# EAGLE design pizerousbhub (EAGLE 7.5.0)
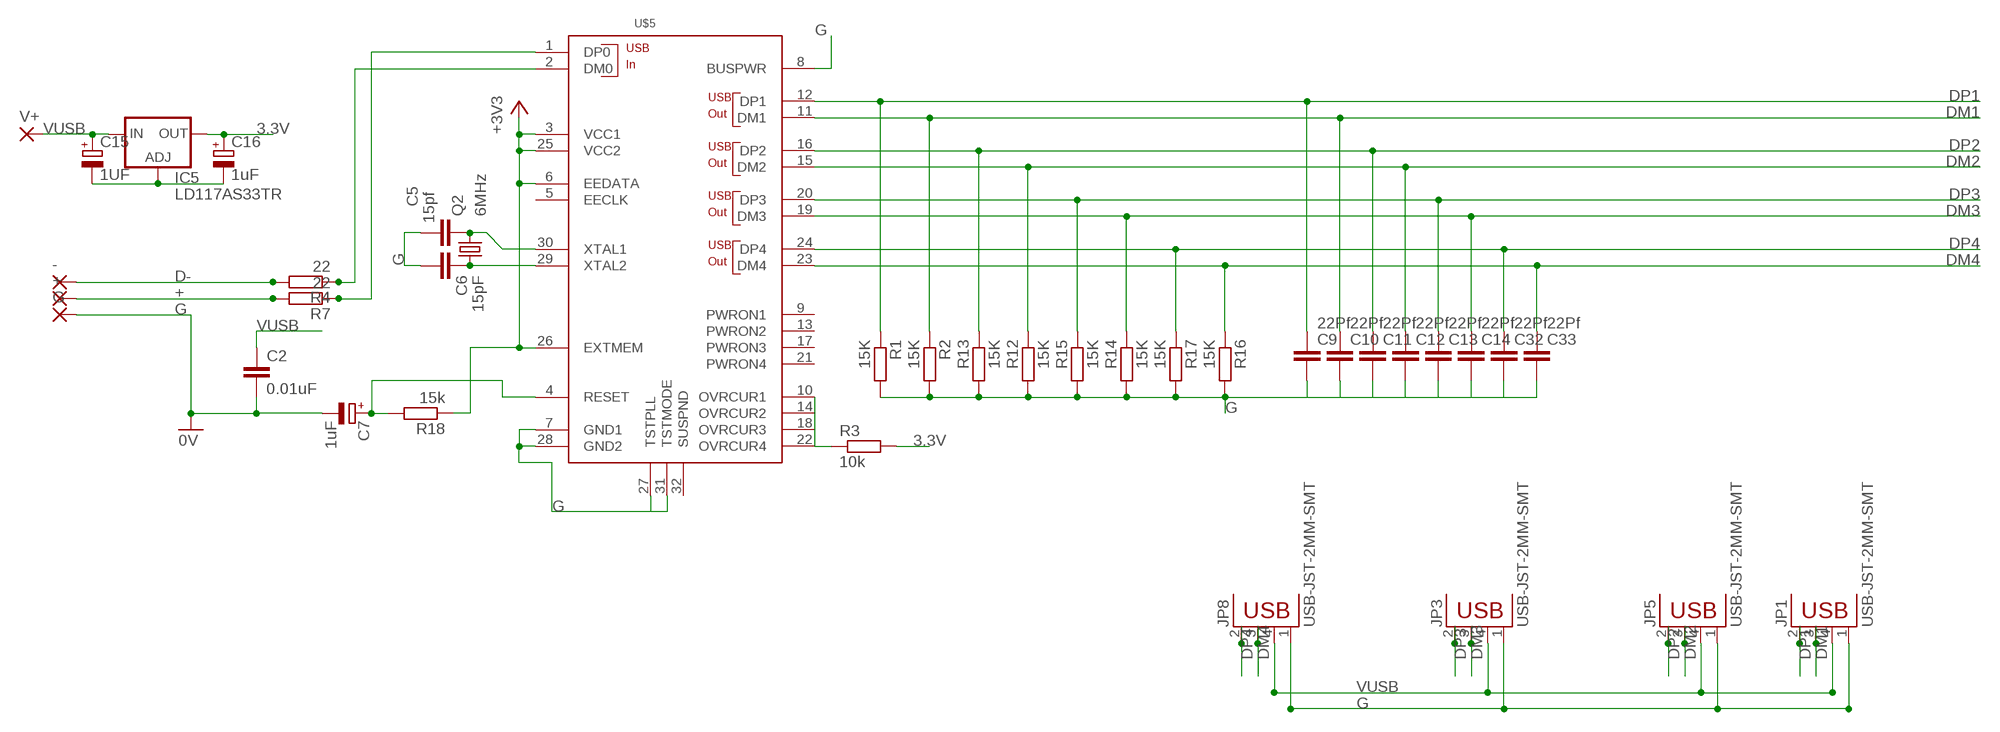
[diagram p0: schematic, sheet 1]

## Parts
+  SMD2  [SMD1,27-2,54]
-  SMD2  [SMD1,27-2,54]
C2  0.01uF  C-EUC0603  [C0603]
C5  15pf  C-EUC0603  [C0603]
C6  15pF  C-EUC0603  [C0603]
C7  1uF  CPOL-EUA/3216-18W  [A/3216-18W]
C9  22Pf  C-EUC0603  [C0603]
C10  22Pf  C-EUC0603  [C0603]
C11  22Pf  C-EUC0603  [C0603]
C12  22Pf  C-EUC0603  [C0603]
C13  22Pf  C-EUC0603  [C0603]
C14  22Pf  C-EUC0603  [C0603]
C15  1UF  CPOL-EUA/3216-18W  [A/3216-18W]
C16  1uF  CPOL-EUC/6032-28R  [C/6032-28R]
C32  22Pf  C-EUC0603  [C0603]
C33  22Pf  C-EUC0603  [C0603]
G  SMD2  [SMD1,27-2,54]
IC5  LD117AS33TR  [SOT223]
JP1  USB-JST-2MM-SMT  [S4B-PH]
JP3  USB-JST-2MM-SMT  [S4B-PH]
JP5  USB-JST-2MM-SMT  [S4B-PH]
JP8  USB-JST-2MM-SMT  [S4B-PH]
Q2  6MHz  CRYSTALCTS406  [CTS406]
R1  15K  R-EU_R0603  [R0603]
R2  15K  R-EU_R0603  [R0603]
R3  10k  R-EU_R0603  [R0603]
R4  22  R-EU_R0603  [R0603]
R7  22  R-EU_R0603  [R0603]
R12  15K  R-EU_R0603  [R0603]
R13  15K  R-EU_R0603  [R0603]
R14  15K  R-EU_R0603  [R0603]
R15  15K  R-EU_R0603  [R0603]
R16  15K  R-EU_R0603  [R0603]
R17  15K  R-EU_R0603  [R0603]
R18  15k  R-EU_R0603  [R0603]
U$5  TUSB2046  [LQFP-32]
V+  SMD2  [SMD1,27-2,54]

## Nets
3.3V: C16.+ IC5.4(OUT) R3.2 R18.1 U$5.3(VCC1) U$5.6(EEDATA) U$5.25(VCC2) U$5.26(EXTMEM) ; supply symbol labelled +3V3
+: +.1(P) R7.2
D-: -.1(P) R4.2
DM0: R4.1 U$5.2(DM0)
DM1: C10.1 JP1.3(D-) R2.1 U$5.11(DM1)
DM2: C12.1 JP5.3(D-) R12.1 U$5.15(DM2)
DM3: C14.1 JP3.3(D-) R14.1 U$5.19(DM3)
DM4: C33.1 JP8.3(D-) R16.1 U$5.23(DM4)
DP0: R7.1 U$5.1(DP0)
DP1: C9.1 JP1.2(D+) R1.1 U$5.12(DP1)
DP2: C11.1 JP5.2(D+) R13.1 U$5.16(DP2)
DP3: C13.1 JP3.2(D+) R15.1 U$5.20(DP3)
DP4: C32.1 JP8.2(D+) R17.1 U$5.24(DP4)
G: C2.2 C5.1 C6.2 C7.- C9.2 C10.2 C11.2 C12.2 C13.2 C14.2 C15.- C16.- C32.2 C33.2 G.1(P) IC5.1(ADJ) JP1.1(GND) JP3.1(GND) JP5.1(GND) JP8.1(GND) R1.2 R2.2 R12.2 R13.2 R14.2 R15.2 R16.2 R17.2 U$5.7(GND1) U$5.8(BUSPWR) U$5.27(TSTPLL) U$5.28(GND2) U$5.31(TSTMODE) ; supply symbol labelled 0V
N$3: R3.1 U$5.10(OVRCUR1) U$5.14(OVRCUR2) U$5.18(OVRCUR3) U$5.22(OVRCUR4)
RESET: C7.+ R18.2 U$5.4(RESET)
VUSB: C2.1 C15.+ IC5.3(IN) JP1.4(VBUS) JP3.4(VBUS) JP5.4(VBUS) JP8.4(VBUS) V+.1(P)
XTAL1: C5.2 Q2.3 U$5.30(XTAL1)
XTAL2: C6.1 Q2.1 U$5.29(XTAL2)
Unconnected: U$5.5(EECLK) U$5.9(PWRON1) U$5.13(PWRON2) U$5.17(PWRON3) U$5.21(PWRON4) U$5.32(SUSPND)

## Library data of the parts
+ - G V+ = wirepad:SMD2: SMD PAD
C2 C5 C6 C9-C14 C32 C33 = rcl:C-EU: CAPACITOR, European symbol
C7 C15 C16 = rcl:CPOL-EU: POLARIZED CAPACITOR, European symbol
IC5 = v-reg:LD117A?*: Low drop fixed and adjustable positive voltage regulators 1 A Source: http://www.st.com/stonline/products/literature/ds/7194/ld1117axx.pdf
JP1 JP3 JP5 JP8 = SparkFun-Connectors:USB: USB Connectors USB-B-PTH is fully proven SKU : PRT-00139/CONN-08278 USB-miniB is fully proven SKU : PRT-00587 USB-A-PCB is untested. USB-A-H is throughly reviewed, but untested. Spark Fun Electronics SKU : PRT-00437 USB-B-SMT is throughly reviewed, but untested. Needs silkscreen touching up. USB-A-S has not been used/tested USB-MB-H has not been used/tested USB-MICROB has been used. CONN-09505; PROD_ID: CONN-08193
Q2 = new_mcp:CRYSTAL: CRYSTAL
R1-R4 R7 R12-R18 = rcl:R-EU_: RESISTOR, European symbol
U$5 = usb-conc:TUSB2046; ORDERCODE: 1470507; SUPPLIER: farnell

## Net classes
1 power: width 0.6 mm, clearance 0.305 mm

## Board
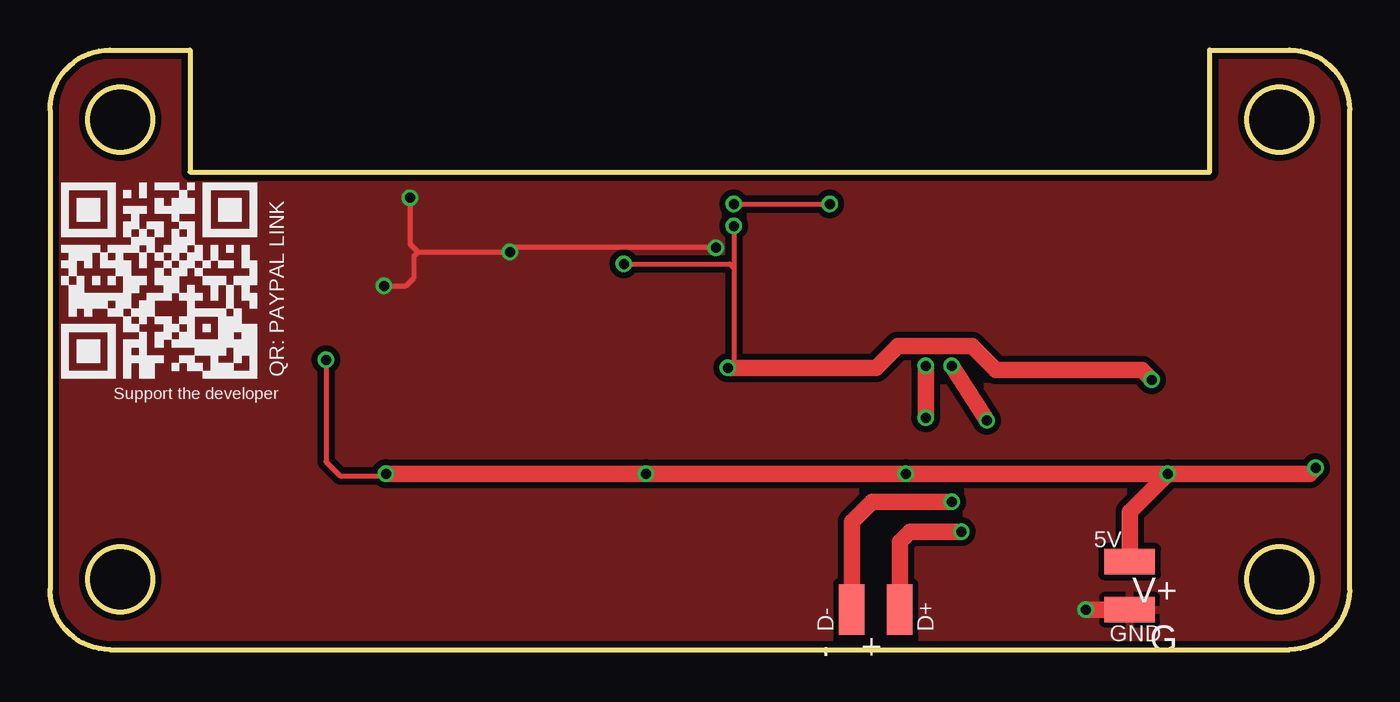
[diagram p1: board, top side]
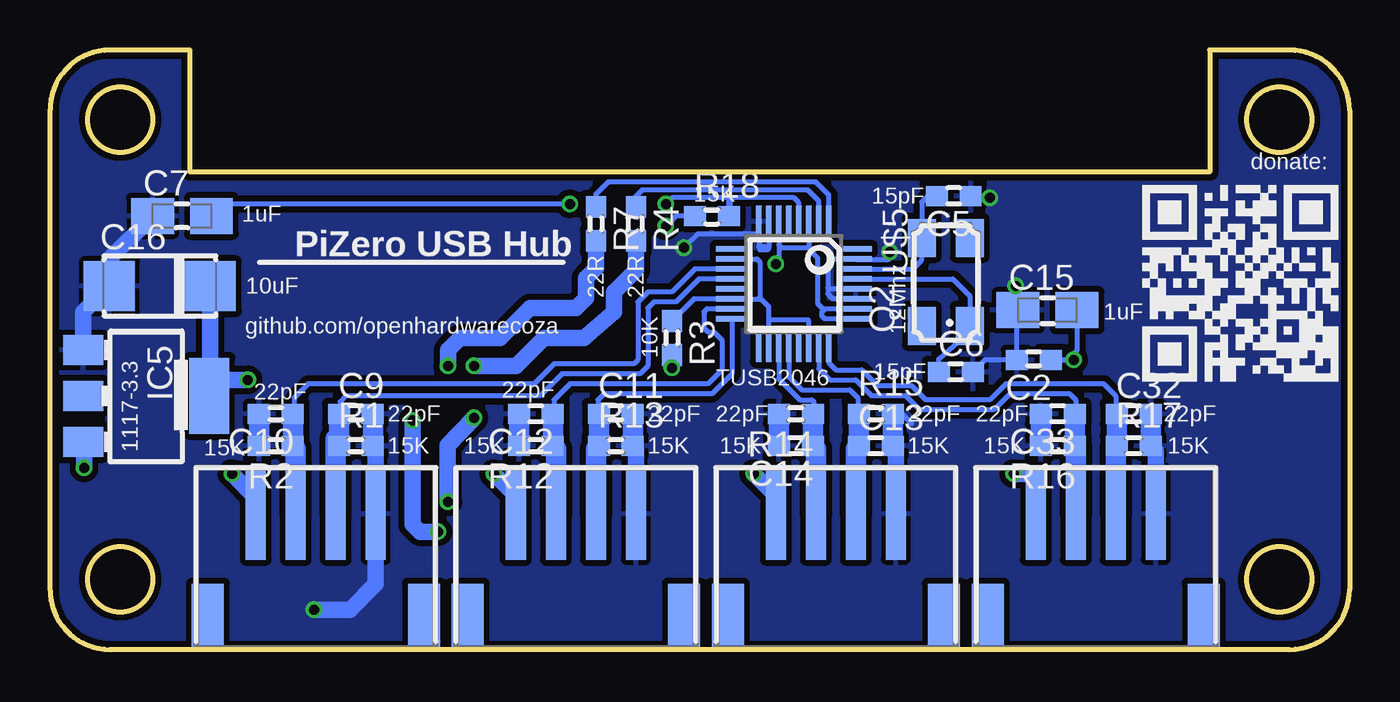
[diagram p2: board, bottom side, seen from below]

Size 65 x 30 mm. Coordinates in mm from the lower left corner, seen from the top.
Outline: 3,30 7,30 7,23.9 58,23.9 58,30 62,30 arc-90 65,27 65,3 arc-90 62,0 3,0 arc-90 0,3 0,27 arc-90 3,30
Outline: circle at 3.51,26.52 radius 1.62
Outline: circle at 61.49,26.52 radius 1.62
Outline: circle at 61.49,3.51 radius 1.62
Outline: circle at 3.51,3.51 radius 1.62
Copper layers (1*16): Top 0.035mm / dielectric 1.5mm / Bottom 0.035mm
Design rules "dirt_cheap_dirty_boards.v1": minimum track width 5mil, minimum drill 12mil, track to track 5mil, track to pad 5mil, pad to pad 5mil, via to via 5mil, smd to smd 0mil, copper to edge 10mil, drill to drill 10mil, minimum pad ring 10mil, minimum via ring 6mil, stop-mask expansion 2mil, vias tented up to drill 25mil, thermal gap 10mil

### Footprints (pad centres in the part's own frame; a part is rotated, then mirrored left to right if it is on the bottom)
SMD1,27-2,54 = smd 1.27 x 2.54: 1 0,0
C0603 = smd 1.1 x 1: 1 -0.85,0; 2 0.85,0
A/3216-18W = smd 2.15 x 1.8: + 1.475,0; - -1.475,0
C/6032-28R = smd 2.55 x 2.5: + 2.525,0; - -2.525,0
SOT223 = smd 1.5 x 2: 1 -2.3,-3.15; 2 0,-3.15; 3 2.3,-3.15 | smd 3.8 x 2: 4 0,3.15
S4B-PH = smd 1 x 4.6: 1 -3,-4.7; 2 -1,-4.7; 3 1,-4.7; 4 3,-4.7 | smd 1.6 x 3.4: P$1 -5.4,0.5; P$2 5.4,0.5
CTS406 = smd 1.9 x 1.4: 1 -2.2,-1.2; 2 2.2,-1.2; 3 2.2,1.2; 4 -2.2,1.2
R0603 = smd 1.1 x 1: 1 -0.85,0; 2 0.85,0
LQFP-32 = smd 0.3 x 1.6: 1 -1.75,-3.1; 2 -1.25,-3.1; 3 -0.75,-3.1; 4 -0.25,-3.1; 5 0.25,-3.1; 6 0.75,-3.1; 7 1.25,-3.1; 8 1.75,-3.1; 17 1.75,3.1; 18 1.25,3.1; 19 0.75,3.1; 20 0.25,3.1; 21 -0.25,3.1; 22 -0.75,3.1; 23 -1.25,3.1; 24 -1.75,3.1 | smd 1.6 x 0.3: 9 3.1,-1.75; 10 3.1,-1.25; 11 3.1,-0.75; 12 3.1,-0.25; 13 3.1,0.25; 14 3.1,0.75; 15 3.1,1.25; 16 3.1,1.75; 25 -3.1,1.75; 26 -3.1,1.25; 27 -3.1,0.75; 28 -3.1,0.25; 29 -3.1,-0.25; 30 -3.1,-0.75; 31 -3.1,-1.25; 32 -3.1,-1.75

### Placement (x,y rotation side)
+  42.5,2 0 top
-  40.1,2 0 top
C2  15.8,14.5 180 bottom
C5  19.8,22.7 180 bottom
C6  19.7,13.9 0 bottom
C7  58.4,21.7 0 bottom
C9  49.7,11.8 0 bottom
C10  53.7,11.8 180 bottom
C11  36.7,11.8 0 bottom
C12  40.7,11.8 180 bottom
C13  23.7,10.2 0 bottom
C14  27.7,10.2 180 bottom
C15  15.11,16.98 0 bottom
C16  59.51,18.18 0 bottom
C32  10.8,11.8 0 bottom
C33  14.6,11.8 180 bottom
G  54,2 90 top
IC5  60.18,12.7 270 bottom
JP1  51.7,2.1 180 bottom
JP3  25.7,2.1 180 bottom
JP5  38.7,2.1 180 bottom
JP8  12.7,2.1 180 bottom
Q2  20.2,18.4 90 bottom
R1  49.7,10.2 0 bottom
R2  53.7,10.2 180 bottom
R3  33.9,15.6 270 bottom
R4  35.7,21.3 270 bottom
R7  37.7,21.3 270 bottom
R12  40.7,10.2 180 bottom
R13  36.7,10.2 0 bottom
R14  27.7,11.8 180 bottom
R15  23.7,11.8 0 bottom
R16  14.6,10.2 180 bottom
R17  10.8,10.2 0 bottom
R18  31.9,21.7 0 bottom
U$5  27.8,18.3 180 bottom
V+  54,4.4 90 top

### Tracks (layer width: path | path; a pad name or v marks a point on that pad's centre or on a via)
3.3V  (via drill 0.5)
  Top 0.254: v34.2,21.2 34.2,19.1 | 34.2,19.1 34.2,14.4 v33.9,14.1 | v28.7,19.3 34,19.3 34.2,19.1
  Top 0.813: v33.9,14.1 41.3,14.1 42.4,15.2 46.1,15.2 47.3,14 54.6,14 v55.1,13.5
  Bottom 0.254: U$5.25 26.25,16.55 26.4,16.7 26.4,16.9 26.25,17.05 U$5.26 26.35,17.05 26.6,17.3 26.6,19.6 27.1,20.1 | U$5.3 27.05,20.15 27.1,20.1 | 27.1,20.1 28.4,20.1 28.55,20.25 U$5.6 28.55,19.45 v28.7,19.3 | R18.1 33.7,21.7 v34.2,21.2
  Bottom 0.813: R3.2 v33.9,14.1 | v55.1,13.5 56.22,13.5 IC5.4 56.98,12.74 C16.+
+  (via drill 0.5)
  Top 0.813: +.1 42.5,5.4 43,5.9 v45.59,5.9 | v46.85,11.47 v45.1,14.2
  Bottom 0.813: v45.59,5.9 46.48,5.9 46.85,6.27 v46.85,11.47 | v45.1,14.2 45.1,15 44.5,15.6 42.5,15.6 41,17.1 38.7,17.1 38.2,17.6 38.2,18.6 37.7,19.1 R7.2
D-  (via drill 0.5)
  Top 0.813: -.1 40.1,6.4 41.1,7.4 v45.1,7.4 | v43.8,11.6 v43.8,14.2
  Bottom 0.813: v45.1,7.4 v45.11,7.4 45.11,10.21 v43.8,11.6 | v43.8,14.2 41.7,14.2 40.3,15.6 38.3,15.6 36.8,16.9 36.8,17.9 35.7,19 R4.2
DM0
  Bottom 0.254: U$5.2 26.55,22.45 27.1,23 35.4,23 35.7,22.7 R4.1
DM1
  Bottom 0.254: U$5.11 32.75,19.05 33.9,17.9 35.1,17.9 35.6,17.4 35.6,14.5 35.8,14.3 39.8,14.3 40.8,13.3 52.1,13.3 52.8,12.6 52.8,11.85 C10.1
  Bottom 1.016: C10.1 R2.1 52.7,10.05 JP1.3
DM2
  Bottom 0.254: U$5.15 32.15,17.05 32.3,16.9 32.3,16.1 32.1,15.9 31.8,15.9 31.4,15.5 31.4,14 32.1,13.3 39,13.3 39.8,12.5 39.8,11.85 C12.1
  Bottom 1.016: C12.1 R12.1 39.7,10.05 JP5.3
DM3
  Bottom 0.254: U$5.19 28.55,13.55 27.5,12.5 26.9,12.5 26.8,12.4 26.8,11.85 R14.1
  Bottom 1.016: R14.1 C14.1 26.7,10.05 JP3.3
DM4
  Bottom 0.254: U$5.23 26.55,14.05 26,13.5 24.7,13.5 23.9,12.7 22.2,12.7 21.5,12 17.8,12 17,12.8 14,12.8 13.7,12.5 13.7,11.85 C33.1
  Bottom 1.016: JP8.3 13.7,10.15 R16.1 C33.1
DP0
  Bottom 0.254: U$5.1 26.05,22.75 26.7,23.4 37.1,23.4 37.7,22.8 R7.1
DP1
  Bottom 0.254: U$5.12 32.55,18.55 33.7,17.4 34.8,17.4 35.1,17.1 35.1,14.2 35.5,13.8 39.4,13.8 40.5,12.7 50.2,12.7 50.5,12.4 50.5,11.85 C9.1
  Bottom 1.016: R1.1 50.55,10.7 | 50.55,10.7 C9.1 | JP1.2 50.7,10.55 50.55,10.7
DP2
  Bottom 0.254: U$5.16 30.9,13.8 31.9,12.8 37.3,12.8 37.6,12.5 37.6,11.85 C11.1
  Bottom 1.016: C11.1 R13.1 37.7,10.05 JP5.2
DP3
  Bottom 0.254: U$5.20 28.05,13.65 27.4,13 25,13 24.6,12.6 24.6,11.85 R15.1
  Bottom 1.016: R15.1 C13.1 24.7,10.05 JP3.2
DP4
  Bottom 0.254: U$5.24 26.05,14.35 25.7,14 24.4,14 23.6,13.2 21.9,13.2 21.2,12.5 18,12.5 17.2,13.3 12.3,13.3 11.7,12.7 11.7,11.85 C32.1
  Bottom 1.016: JP8.2 11.7,10.15 R17.1 C32.1
G  (via drill 0.5)
  Top 0.254: v33.3,20.1 23.1,20.1 23,20 v23,19.9 18.4,19.9 | v18,22.6 18,20.3 18.4,19.9 | v16.7,18.2 17.8,18.2 18.2,18.6 18.2,19.7 18.4,19.9
  Top 0.813: G.1 v51.8,2
  Bottom 0.254: U$5.7 29.05,20.15 | 29.05,20.15 29.1,20 29.5,20 29.55,20.15 U$5.8 | 26.1,18.1 26.1,19.3 25.85,19.55 U$5.31 24.65,19.5 23.1,19.5 23,19.6 v23,19.9 | 26.1,18.1 26.1,17.8 25.85,17.55 U$5.27 | U$5.28 26.05,18.05 26.1,18.1 | C2.2 18.25,14.5 C6.2 | C2.2 16.65,16.91 C15.- 16.58,18.08 v16.7,18.2 | C2.2 16.65,14.45 16.7,14.4 | R15.2 22.4,11.8 21.9,11.3 | 29.05,20.15 29.45,20.15 29.5,20.2 29.5,20.7 29.6,20.8 32.6,20.8 v33.3,20.1 | C5.1 18.1,22.7 v18,22.6
  Bottom 0.813: JP8.1 9.7,9.95 R17.2 | JP3.1 22.7,10.05 C13.2 | JP5.1 35.7,10.05 R13.2 | R1.2 48.7,10.05 JP1.1 48.7,3.3 50,2 v51.8,2 | C7.- 62.03,19.55 C16.- 63.33,16.88 IC5.1
  Bottom 1.016: R16.2 C33.2 | R17.2 C32.2 | C13.2 R15.2 | C14.2 R14.2 | R13.2 C11.2 | R12.2 C12.2 | R1.2 C9.2 | R2.2 C10.2
  pour Bottom (isolate 0.305): -0.2,0 -0.2,30 65.2,30 65.2,-0.5 -0.2,-0.5
  pour Top (isolate 0.305): -0.26,30.23 65.26,30.23 65.26,-0.26 -0.26,-0.26
N$3
  Bottom 0.254: 29.6,17.55 U$5.14 32.8,17.55 R3.1 | 29.6,17.55 29.45,17.55 29.05,17.15 29.05,16.5 | U$5.18 29.05,16.5 | U$5.22 27.05,16.45 27.1,16.5 29.05,16.5 | U$5.10 29.65,19.55 29.5,19.4 29.5,17.65 29.6,17.55
RESET  (via drill 0.5)
  Top 0.254: v34.2,22.3 v39,22.3
  Bottom 0.254: U$5.4 27.55,22.35 27.8,22.6 31,22.6 | 31,22.6 31,21.75 R18.2 31.05,22.45 31,22.6 | 31,22.6 33.9,22.6 v34.2,22.3 | v39,22.3 56.33,22.3 C7.+
VUSB  (via drill 0.5)
  Top 0.254: v13.8,14.5 13.8,9.4 14.5,8.7 16.7,8.7 v16.8,8.8
  Top 0.813: v55.9,8.8 v42.8,8.8 v29.8,8.8 v16.8,8.8 | V+.1 54,6.9 v55.9,8.8 | v55.9,8.8 63,8.8 v63.3,9.1
  Bottom 0.254: C15.+ 13.63,14.97 14.1,14.5 C2.1 v13.8,14.5
  Bottom 0.813: JP1.4 54.7,7.6 v55.9,8.8 | v16.8,8.8 16.1,8.8 15.7,8.4 JP8.4 | JP3.4 28.7,7.7 v29.8,8.8 | JP5.4 41.7,7.7 v42.8,8.8 | v63.3,9.1 63.3,10.37 IC5.3
XTAL1
  Bottom 0.254: U$5.30 21.85,19.05 21.4,19.5 Q2.3 21.4,22.4 21.1,22.7 C5.2
XTAL2
  Bottom 0.254: U$5.29 19.85,18.55 19,17.7 Q2.1 19.6,15.6 19.6,15.4 20.55,14.55 C6.1

### Text on the board
topsilkoh: QR: PAYPAL LINK | Support the developer | 5V | D- | D+ | GND
BSILKOH: donate: | 15pF | 15K | PiZero USB Hub | 1uF | 22R | 22R | 10uF | 1uF | 12Mhz | github.com/openhardwarecoza | 10K | 15pF | TUSB2046 | 22pF | 22pF | 22pF | 22pF | 22pF | 22pF | 22pF | 22pF | 15K | 15K | 15K | 15K | 15K | 15K | 15K | 15K | 1117-3.3